# Altium schematic sheet WS2812_MATRIX_7.SchDoc
size A4
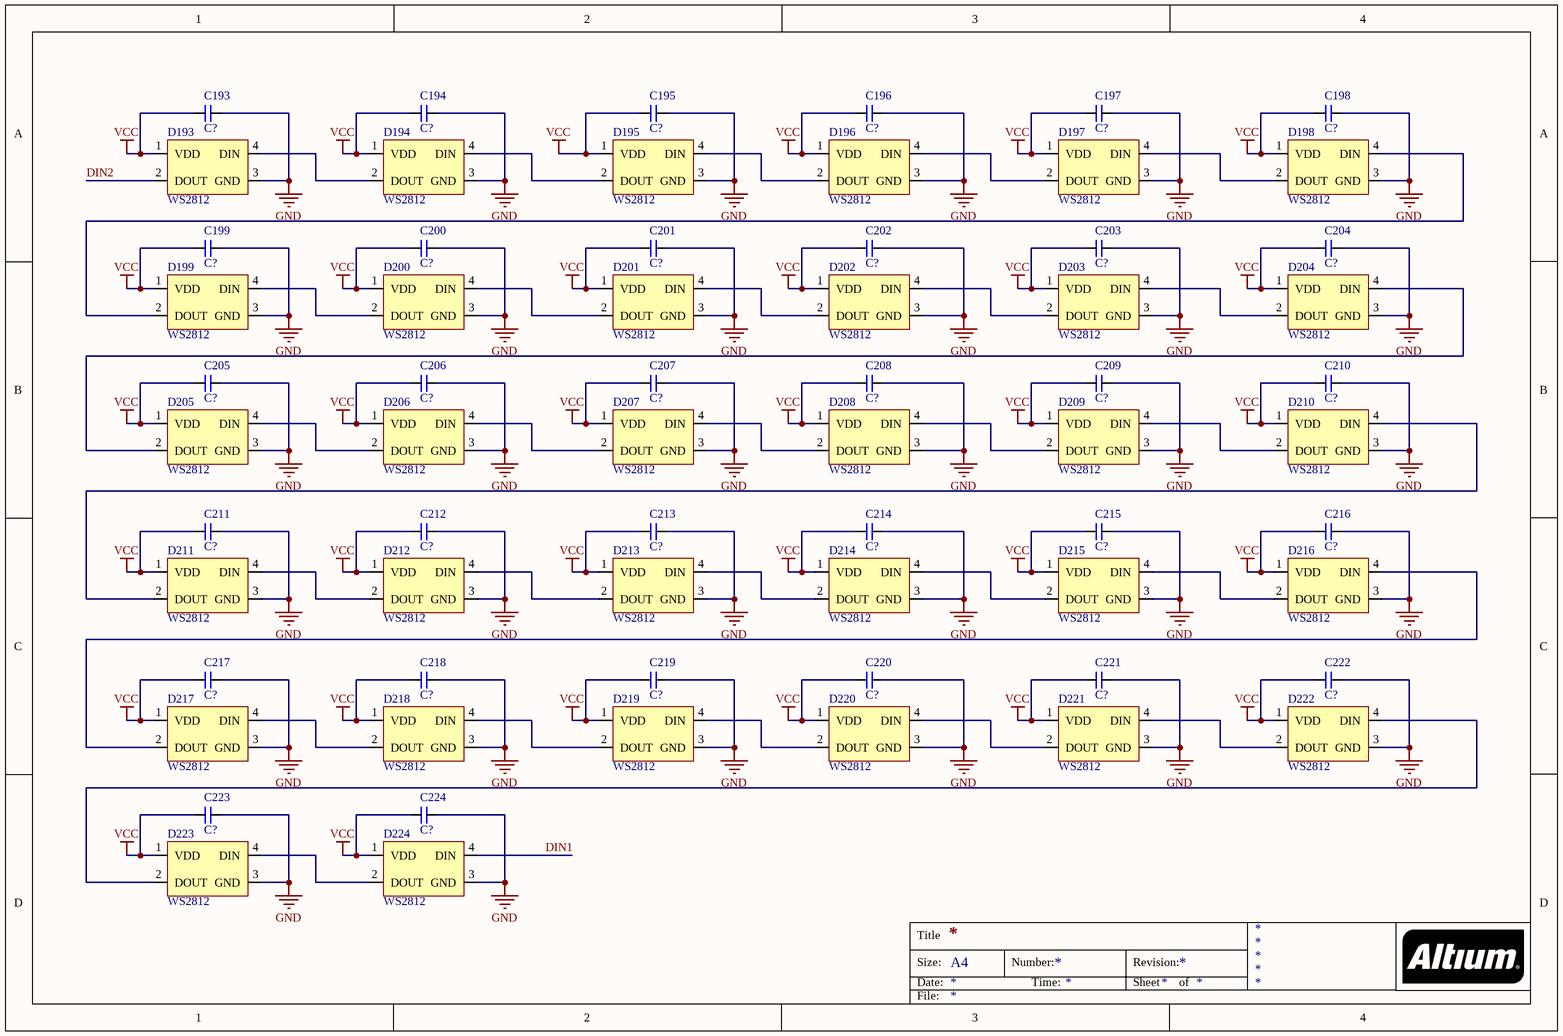
[diagram p0: WS2812_MATRIX_7.SchDoc]

## Parts
C193  C?  [C0603]
C194  C?  [C0603]
C195  C?  [C0603]
C196  C?  [C0603]
C197  C?  [C0603]
C198  C?  [C0603]
C199  C?  [C0603]
C200  C?  [C0603]
C201  C?  [C0603]
C202  C?  [C0603]
C203  C?  [C0603]
C204  C?  [C0603]
C205  C?  [C0603]
C206  C?  [C0603]
C207  C?  [C0603]
C208  C?  [C0603]
C209  C?  [C0603]
C210  C?  [C0603]
C211  C?  [C0603]
C212  C?  [C0603]
C213  C?  [C0603]
C214  C?  [C0603]
C215  C?  [C0603]
C216  C?  [C0603]
C217  C?  [C0603]
C218  C?  [C0603]
C219  C?  [C0603]
C220  C?  [C0603]
C221  C?  [C0603]
C222  C?  [C0603]
C223  C?  [C0603]
C224  C?  [C0603]
D193  WS2812  [WS2812_3528]
D194  WS2812  [WS2812_3528]
D195  WS2812  [WS2812_3528]
D196  WS2812  [WS2812_3528]
D197  WS2812  [WS2812_3528]
D198  WS2812  [WS2812_3528]
D199  WS2812  [WS2812_3528]
D200  WS2812  [WS2812_3528]
D201  WS2812  [WS2812_3528]
D202  WS2812  [WS2812_3528]
D203  WS2812  [WS2812_3528]
D204  WS2812  [WS2812_3528]
D205  WS2812  [WS2812_3528]
D206  WS2812  [WS2812_3528]
D207  WS2812  [WS2812_3528]
D208  WS2812  [WS2812_3528]
D209  WS2812  [WS2812_3528]
D210  WS2812  [WS2812_3528]
D211  WS2812  [WS2812_3528]
D212  WS2812  [WS2812_3528]
D213  WS2812  [WS2812_3528]
D214  WS2812  [WS2812_3528]
D215  WS2812  [WS2812_3528]
D216  WS2812  [WS2812_3528]
D217  WS2812  [WS2812_3528]
D218  WS2812  [WS2812_3528]
D219  WS2812  [WS2812_3528]
D220  WS2812  [WS2812_3528]
D221  WS2812  [WS2812_3528]
D222  WS2812  [WS2812_3528]
D223  WS2812  [WS2812_3528]
D224  WS2812  [WS2812_3528]

## Nets
GND: C193.2 C194.2 C195.2 C196.2 C197.2 C198.2 C199.2 C200.2 C201.2 C202.2 C203.2 C204.2 C205.2 C206.2 C207.2 C208.2 C209.2 C210.2 C211.2 C212.2 C213.2 C214.2 C215.2 C216.2 C217.2 C218.2 C219.2 C220.2 C221.2 C222.2 C223.2 C224.2 D193.3(GND) D194.3(GND) D195.3(GND) D196.3(GND) D197.3(GND) D198.3(GND) D199.3(GND) D200.3(GND) D201.3(GND) D202.3(GND) D203.3(GND) D204.3(GND) D205.3(GND) D206.3(GND) D207.3(GND) D208.3(GND) D209.3(GND) D210.3(GND) D211.3(GND) D212.3(GND) D213.3(GND) D214.3(GND) D215.3(GND) D216.3(GND) D217.3(GND) D218.3(GND) D219.3(GND) D220.3(GND) D221.3(GND) D222.3(GND) D223.3(GND) D224.3(GND)
VCC: C193.1 C194.1 C195.1 C196.1 C197.1 C198.1 C199.1 C200.1 C201.1 C202.1 C203.1 C204.1 C205.1 C206.1 C207.1 C208.1 C209.1 C210.1 C211.1 C212.1 C213.1 C214.1 C215.1 C216.1 C217.1 C218.1 C219.1 C220.1 C221.1 C222.1 C223.1 C224.1 D193.1(VDD) D194.1(VDD) D195.1(VDD) D196.1(VDD) D197.1(VDD) D198.1(VDD) D199.1(VDD) D200.1(VDD) D201.1(VDD) D202.1(VDD) D203.1(VDD) D204.1(VDD) D205.1(VDD) D206.1(VDD) D207.1(VDD) D208.1(VDD) D209.1(VDD) D210.1(VDD) D211.1(VDD) D212.1(VDD) D213.1(VDD) D214.1(VDD) D215.1(VDD) D216.1(VDD) D217.1(VDD) D218.1(VDD) D219.1(VDD) D220.1(VDD) D221.1(VDD) D222.1(VDD) D223.1(VDD) D224.1(VDD)
DIN1: D224.4(DIN)
DIN2: D193.2(DOUT)
NetD193_4: D193.4(DIN) D194.2(DOUT)
NetD194_4: D194.4(DIN) D195.2(DOUT)
NetD195_4: D195.4(DIN) D196.2(DOUT)
NetD196_4: D196.4(DIN) D197.2(DOUT)
NetD197_4: D197.4(DIN) D198.2(DOUT)
NetD198_4: D198.4(DIN) D199.2(DOUT)
NetD199_4: D199.4(DIN) D200.2(DOUT)
NetD200_4: D200.4(DIN) D201.2(DOUT)
NetD201_4: D201.4(DIN) D202.2(DOUT)
NetD202_4: D202.4(DIN) D203.2(DOUT)
NetD203_4: D203.4(DIN) D204.2(DOUT)
NetD204_4: D204.4(DIN) D205.2(DOUT)
NetD205_4: D205.4(DIN) D206.2(DOUT)
NetD206_4: D206.4(DIN) D207.2(DOUT)
NetD207_4: D207.4(DIN) D208.2(DOUT)
NetD208_4: D208.4(DIN) D209.2(DOUT)
NetD209_4: D209.4(DIN) D210.2(DOUT)
NetD210_4: D210.4(DIN) D211.2(DOUT)
NetD211_4: D211.4(DIN) D212.2(DOUT)
NetD212_4: D212.4(DIN) D213.2(DOUT)
NetD213_4: D213.4(DIN) D214.2(DOUT)
NetD214_4: D214.4(DIN) D215.2(DOUT)
NetD215_4: D215.4(DIN) D216.2(DOUT)
NetD216_4: D216.4(DIN) D217.2(DOUT)
NetD217_4: D217.4(DIN) D218.2(DOUT)
NetD218_4: D218.4(DIN) D219.2(DOUT)
NetD219_4: D219.4(DIN) D220.2(DOUT)
NetD220_4: D220.4(DIN) D221.2(DOUT)
NetD221_4: D221.4(DIN) D222.2(DOUT)
NetD222_4: D222.4(DIN) D223.2(DOUT)
NetD223_4: D223.4(DIN) D224.2(DOUT)

## Notes on the sheet
- Title
- Size:
- Date:
- A4
- Number:
- Time:
- Revision:
- Sheet
- of
- File:

## Library data of the parts
C193-C224 = CAP